# EAGLE schematic hello echo_Arpi_02 (EAGLE 8.0.2)
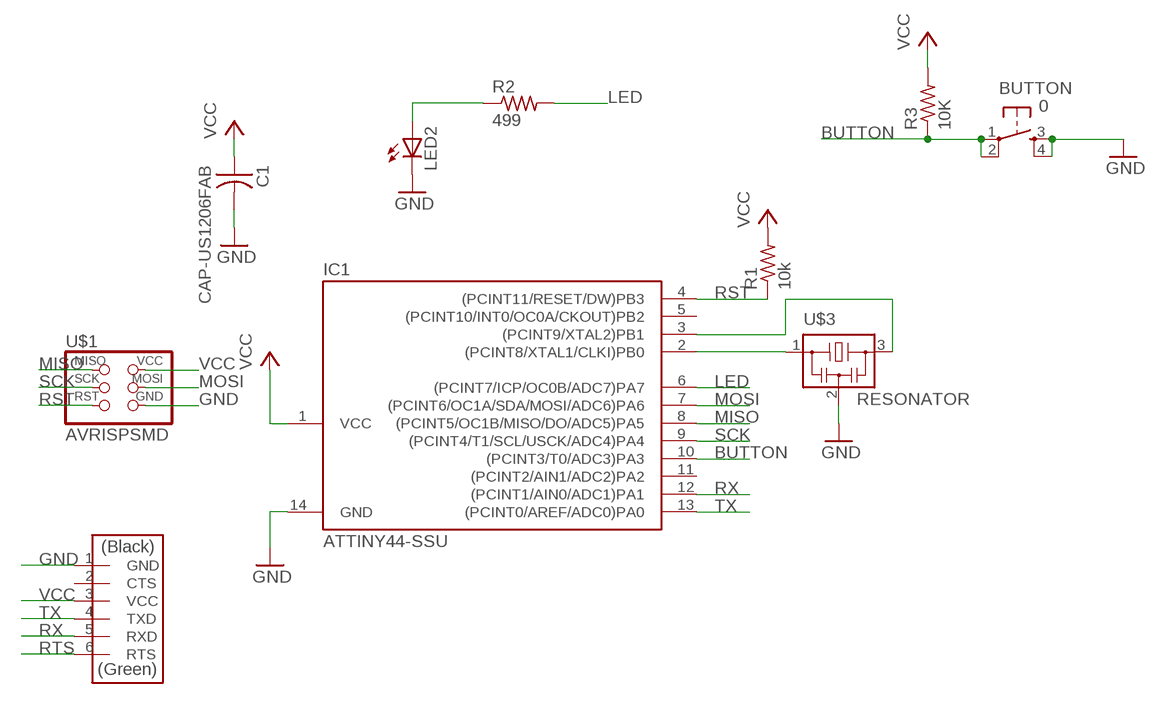
[diagram p0: schematic, sheet 1]

## Parts
BUTTON  0  6MM_SWITCH6MM_SWITCH  [6MM_SWITCH]
C1  CAP-US1206FAB  [C1206FAB]
IC1  ATTINY44-SSU  [SOIC14]
LED2  LEDKA-3528ASYC  [KA-3528ASYC]
R1  10k  RES-US1206FAB  [R1206FAB]
R2  499  RES-US1206FAB  [R1206FAB]
R3  10K  RES-US1206FAB  [R1206FAB]
U$1  AVRISPSMD  [2X03SMD]
U$2  FTDI-SMD-HEADER  [1X06SMD]
U$3  RESONATOR  [EFOBM]

## Nets
BUTTON: BUTTON.1(P) BUTTON.2(P1) IC1.10((PCINT3/T0/ADC3)PA3) R3.1
GND: BUTTON.3(S) BUTTON.4(S1) C1.2 IC1.14(GND) LED2.C U$1.6(GND) U$2.1(GND) U$3.2
LED: IC1.6((PCINT7/ICP/OC0B/ADC7)PA7) R2.2
MISO: IC1.8((PCINT5/OC1B/MISO/DO/ADC5)PA5) U$1.1(MISO)
MOSI: IC1.7((PCINT6/OC1A/SDA/MOSI/ADC6)PA6) U$1.4(MOSI)
N$2: LED2.A R2.1
N$3: IC1.2((PCINT8/XTAL1/CLKI)PB0) U$3.1
N$4: IC1.3((PCINT9/XTAL2)PB1) U$3.3
RST: IC1.4((PCINT11/RESET/DW)PB3) R1.1 U$1.5(RST)
RTS: U$2.6(RTS)
RX: IC1.12((PCINT1/AIN0/ADC1)PA1) U$2.5(RXD)
SCK: IC1.9((PCINT4/T1/SCL/USCK/ADC4)PA4) U$1.3(SCK)
TX: IC1.13((PCINT0/AREF/ADC0)PA0) U$2.4(TXD)
VCC: C1.1 IC1.1(VCC) R1.2 R3.2 U$1.2(VCC) U$2.3(VCC)
Unconnected: IC1.5((PCINT10/INT0/OC0A/CKOUT)PB2) IC1.11((PCINT2/AIN1/ADC2)PA2) U$2.2(CTS)

## Library data of the parts
BUTTON = fab:6MM_SWITCH: OMRON SWITCH
C1 = fab:CAP-US
IC1 = fab:ATTINY44
LED2 = led:LED: LED OSRAM: - CHIPLED LG R971, LG N971, LY N971, LG Q971, LY Q971, LO R971, LY R971 LH N974, LH R974 LS Q976, LO Q976, LY Q976 LO Q996 - Hyper CHIPLED LW Q18S LB Q993, LB Q99A, LB R99A - SideLED LS A670, LO A670, LY A670, LG A670, LP A670 LB A673, LV A673, LT A673, LW A673 LH A674 LY A675 LS A676, LA A676, LO A676, LY A676, LW A676 LS A679, LY A679, LG A679 - Hyper Micro SIDELED® LS Y876, LA Y876, LO Y876, LY Y876 LT Y87S - SmartLED LW L88C, LW L88S LB L89C, LB L89S, LG L890 LS L89K, LO L89K, LY L89K LS L896, LA L896, LO L896, LY L896 - TOPLED LS T670, LO T670, LY T670, LG T670, LP T670 LSG T670, LSP T670, LSY T670, LOP T670, LYG T670 LG T671, LOG T671, LSG T671 LB T673, LV T673, LT T673, LW T673 LH T674 LS T676, LA T676, LO T676, LY T676, LB T676, LH T676, LSB T676, LW T676 LB T67C, LV T67C, LT T67C, LS T67K, LO T67K, LY T67K, LW E67C LS E67B, LA E67B, LO E67B, LY E67B, LB E67C, LV E67C, LT E67C LW T67C LS T679, LY T679, LG T679 LS T770, LO T770, LY T770, LG T770, LP T770 LB T773, LV T773, LT T773, LW T773 LH T774 LS E675, LA E675, LY E675, LS T675 LS T776, LA T776, LO T776, LY T776, LB T776 LHGB T686 LT T68C, LB T68C - Hyper Mini TOPLED® LB M676 - Mini TOPLED Santana® LG M470 LS M47K, LO M47K, LY M47K Source: http://www.osram.convergy.de LUXEON: - LUMILED® LXK2-PW12-R00, LXK2-PW12-S00, LXK2-PW14-U00, LXK2-PW14-V00 LXK2-PM12-R00, LXK2-PM12-S00, LXK2-PM14-U00 LXK2-PE12-Q00, LXK2-PE12-R00, LXK2-PE12-S00, LXK2-PE14-T00, LXK2-PE14-U00 LXK2-PB12-K00, LXK2-PB12-L00, LXK2-PB12-M00, LXK2-PB14-N00, LXK2-PB14-P00, LXK2-PB14-Q00 LXK2-PR12-L00, LXK2-PR12-M00, LXK2-PR14-Q00, LXK2-PR14-R00 LXK2-PD12-Q00, LXK2-PD12-R00, LXK2-PD12-S00 LXK2-PH12-R00, LXK2-PH12-S00 LXK2-PL12-P00, LXK2-PL12-Q00, LXK2-PL12-R00 Source: www.luxeon.com KINGBRIGHT: KA-3528ASYC Source: www.kingbright.com
R1-R3 = fab:RES-US: Resistor (US Symbol) Variants with postfix FAB are widened to allow the routing of internal traces
U$1 = fab:AVRISP
U$2 = fab:FTDI-SMD-HEADER
U$3 = fab:RESONATOR